# EAGLE design Audio-6 (EAGLE 7.2.0)
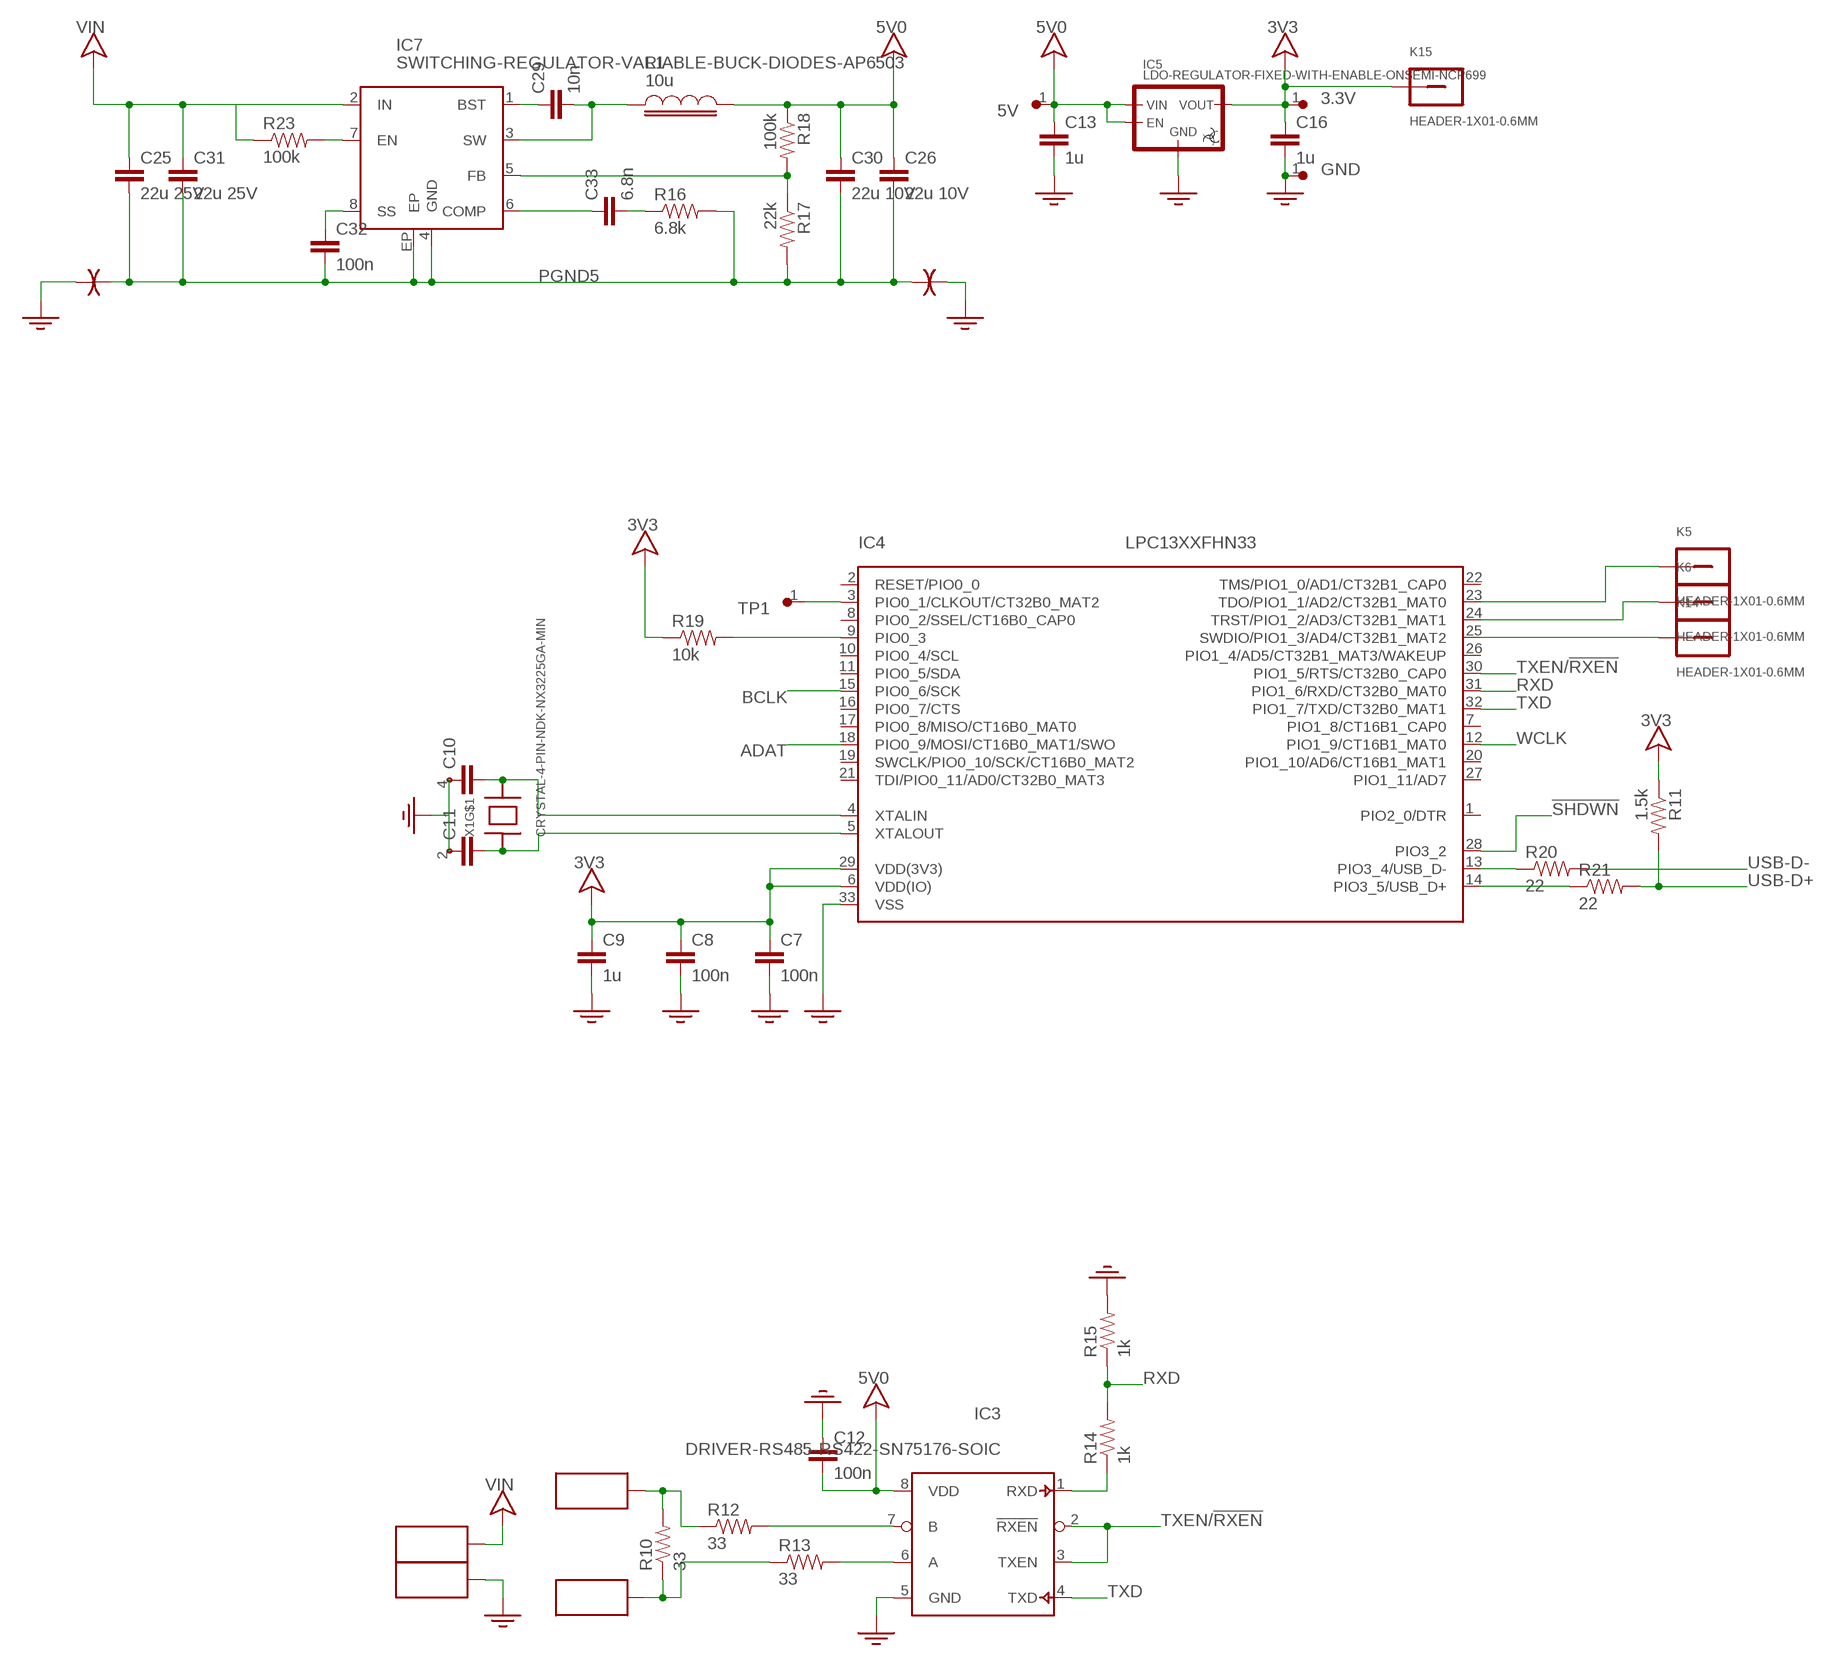
[diagram p0: schematic, sheet 1, part 1 of 2]
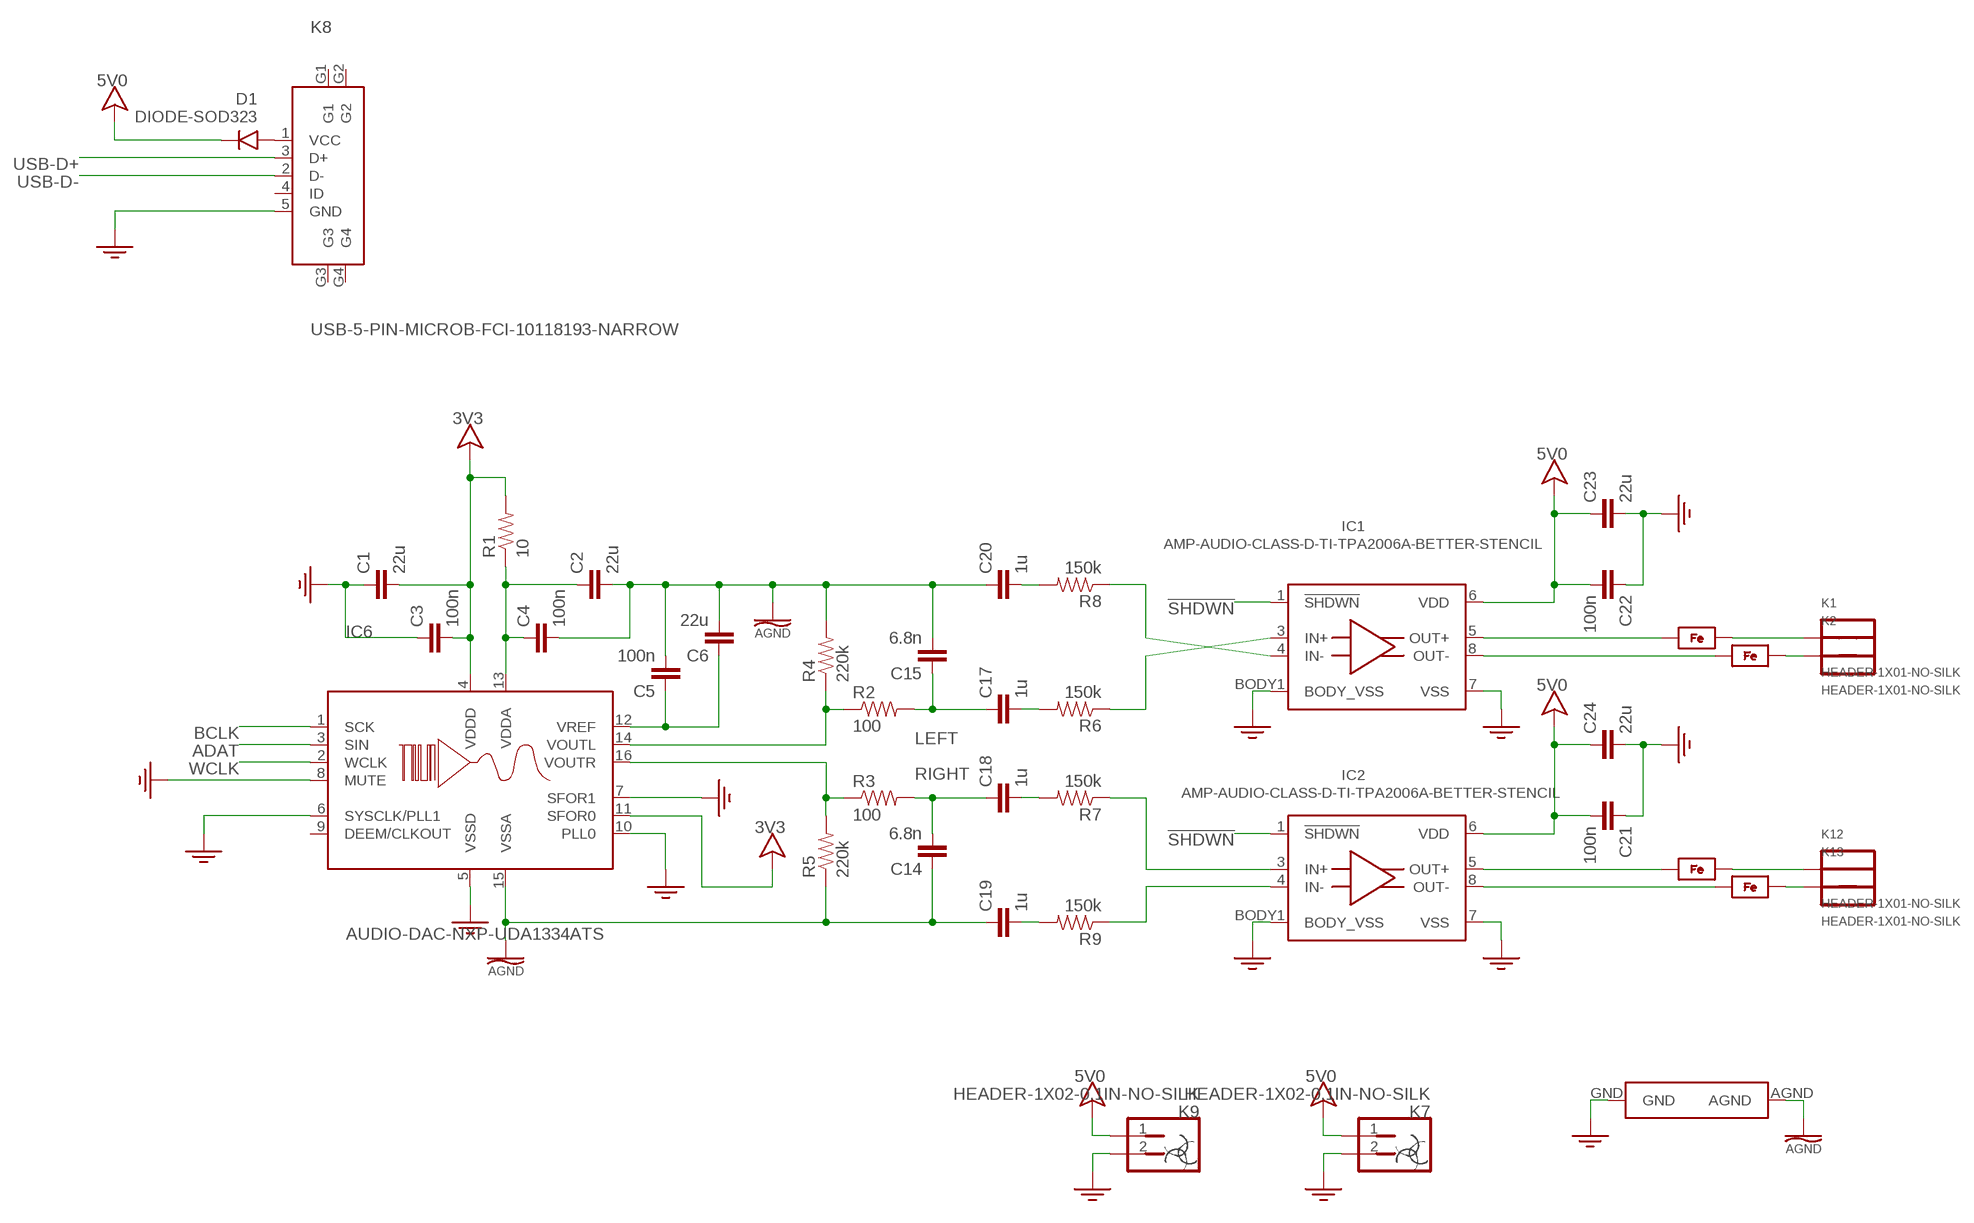
[diagram p1: schematic, sheet 1, part 2 of 2]

## Parts
3.3V  TEST-POINT-0.75MM  [TEST-POINT-0.75MM]
5V  TEST-POINT-0.75MM  [TEST-POINT-0.75MM]
C1  22u  CAP-1206-MIN  [1206-MIN]
C2  22u  CAP-1206-MIN  [1206-MIN]
C3  100n  CAP-0603-MIN  [0603-MIN]
C4  100n  CAP-0603-MIN  [0603-MIN]
C5  100n  CAP-0603-MIN  [0603-MIN]
C6  22u  CAP-1206-MIN  [1206-MIN]
C7  100n  CAP-0603-MIN  [0603-MIN]
C8  100n  CAP-0603-MIN  [0603-MIN]
C9  1u  CAP-0603-MIN  [0603-MIN]
C10  CAP-0603-MIN  [0603-MIN]
C11  CAP-0603-MIN  [0603-MIN]
C12  100n  CAP-0603-MIN  [0603-MIN]
C13  1u  CAP-0603-MIN  [0603-MIN]
C14  6.8n  CAP-0603-MIN  [0603-MIN]
C15  6.8n  CAP-0603-MIN  [0603-MIN]
C16  1u  CAP-0603-MIN  [0603-MIN]
C17  1u  CAP-0603-MIN  [0603-MIN]
C18  1u  CAP-0603-MIN  [0603-MIN]
C19  1u  CAP-0603-MIN  [0603-MIN]
C20  1u  CAP-0603-MIN  [0603-MIN]
C21  100n  CAP-0603-MIN  [0603-MIN]
C22  100n  CAP-0603-MIN  [0603-MIN]
C23  22u  CAP-1206-MIN  [1206-MIN]
C24  22u  CAP-1206-MIN  [1206-MIN]
C25  22u 25V  CAP-1206  [1206]
C26  22u 10V  CAP-1206  [1206]
C29  10n  CAP-0603-MIN  [0603-MIN]
C30  22u 10V  CAP-1206  [1206]
C31  22u 25V  CAP-1206  [1206]
C32  100n  CAP-0603-MIN  [0603-MIN]
C33  6.8n  CAP-0603-MIN  [0603-MIN]
D1  DIODE-SOD323  [SOD323]
FB1  FERRITE-BEAD-0603-MIN  [0603-MIN]
FB2  FERRITE-BEAD-0603-MIN  [0603-MIN]
FB3  FERRITE-BEAD-0603-MIN  [0603-MIN]
FB4  FERRITE-BEAD-0603-MIN  [0603-MIN]
GND  TEST-POINT-0.75MM  [TEST-POINT-0.75MM]
IC1  AMP-AUDIO-CLASS-D-TI-TPA2006A-BETTER-STENCIL  [QFN8-3X3MM-TI-TPA200X-BETTER-STENCIL]
IC2  AMP-AUDIO-CLASS-D-TI-TPA2006A-BETTER-STENCIL  [QFN8-3X3MM-TI-TPA200X-BETTER-STENCIL]
IC3  DRIVER-RS485-RS422-SN75176-SOIC  [EIAJ-SOIC8]
IC4  LPC13XXFHN33  [HVQFN33-7X7MM]
IC5  LDO-REGULATOR-FIXED-WITH-ENABLE-ONSEMI-NCP699  [SOT23-5]
IC6  AUDIO-DAC-NXP-UDA1334ATS  [TSSOP16]
IC7  SWITCHING-REGULATOR-VARIABLE-BUCK-DIODES-AP6503  [EIAJ-SOIC8-3.9MM-EXPOSED-PAD]
K1  HEADER-1X01-NO-SILK  [HEADER-1X01-NO-SILK]
K2  HEADER-1X01-NO-SILK  [HEADER-1X01-NO-SILK]
K3  SPEAKER-BLOCK  [SPEAKER-BLOCK]
K4  SPEAKER-BLOCK  [SPEAKER-BLOCK]
K5  HEADER-1X01-0.6MM  [HEADER-1X01-0.6MM-DIAM]
K6  HEADER-1X01-0.6MM  [HEADER-1X01-0.6MM-DIAM]
K7  HEADER-1X02-0.1IN-NO-SILK  [HEADER-1X02-NO-SILK]
K8  USB-5-PIN-MICROB-FCI-10118193-NARROW  [USB-MICROB-FCI-10118193-NARROW]
K9  HEADER-1X02-0.1IN-NO-SILK  [HEADER-1X02-NO-SILK]
K10  SPEAKER-BLOCK  [SPEAKER-BLOCK]
K11  SPEAKER-BLOCK  [SPEAKER-BLOCK]
K12  HEADER-1X01-NO-SILK  [HEADER-1X01-NO-SILK]
K13  HEADER-1X01-NO-SILK  [HEADER-1X01-NO-SILK]
K14  HEADER-1X01-0.6MM  [HEADER-1X01-0.6MM-DIAM]
K15  HEADER-1X01-0.6MM  [HEADER-1X01-0.6MM-DIAM]
L1  10u  INDUCTOR-6X6MM  [INDUCTOR-SMD-6X6MM]
R1  10  RESISTOR-0603-MIN  [0603-MIN]
R2  100  RESISTOR-0603-MIN  [0603-MIN]
R3  100  RESISTOR-0603-MIN  [0603-MIN]
R4  220k  RESISTOR-0603-MIN  [0603-MIN]
R5  220k  RESISTOR-0603-MIN  [0603-MIN]
R6  150k  RESISTOR-0603-MIN  [0603-MIN]
R7  150k  RESISTOR-0603-MIN  [0603-MIN]
R8  150k  RESISTOR-0603-MIN  [0603-MIN]
R9  150k  RESISTOR-0603-MIN  [0603-MIN]
R10  33  RESISTOR-0805  [0805-MIN]
R11  1.5k  RESISTOR-0603-MIN  [0603-MIN]
R12  33  RESISTOR-0805  [0805-MIN]
R13  33  RESISTOR-0805  [0805-MIN]
R14  1k  RESISTOR-0603-MIN  [0603-MIN]
R15  1k  RESISTOR-0603-MIN  [0603-MIN]
R16  6.8k  RESISTOR-0603-MIN  [0603-MIN]
R17  22k  RESISTOR-0603-MIN  [0603-MIN]
R18  100k  RESISTOR-0603-MIN  [0603-MIN]
R19  10k  RESISTOR-0603-MIN  [0603-MIN]
R20  22  RESISTOR-0603-MIN  [0603-MIN]
R21  22  RESISTOR-0603-MIN  [0603-MIN]
R23  100k  RESISTOR-0603-MIN  [0603-MIN]
TP1  TEST-POINT-0.75MM  [TEST-POINT-0.75MM]
U1  GND-ISOLATOR-0.032"  [GND-ISOLATOR-0.032"]
U4  GND-ISOLATOR-0.032"  [GND-ISOLATOR-0.032"]
U$4  GND-AGND-CONNECTION  [GND-AGND-CONNECTION]
X1  CRYSTAL-4-PIN-NDK-NX3225GA-MIN  [CRYSTAL-NDK-NX3225GA-3X2.5MM-MIN]

## Nets
3V3: 3.3V.1 C1.1 C3.1 C7.2 C8.2 C9.2 C16.2 IC4.6(VDD(IO)) IC4.29(VDD(3V3)) IC5.5(VOUT) IC6.4(VDDD) IC6.11(SFOR0) K15.P$1 R1.2 R11.1 R19.1 ; supply symbol labelled V
5V0: 5V.1 C12.1 C13.2 C21.1 C22.1 C23.2 C24.2 C26.2 C30.2 D1.K IC1.6(VDD) IC2.6(VDD) IC3.8(VDD) IC5.1(VIN) IC5.3(EN) K7.1 K9.1 L1.2 R18.1 ; supply symbol labelled V
5V0FB: IC7.5(FB) R17.1 R18.2
!SHDWN: IC1.1(!SHDWN) IC2.1(!SHDWN) IC4.28(PIO3_2)
ADAT: IC4.18(PIO0_9/MOSI/CT16B0_MAT1/SWO) IC6.3(SIN)
AGND: C2.1 C4.1 C5.1 C6.1 C14.2 C15.1 C19.2 C20.2 IC6.15(VSSA) R4.2 R5.1 U$4.AGND
BCLK: IC4.15(PIO0_6/SCK) IC6.1(SCK)
BOOT: IC4.3(PIO0_1/CLKOUT/CT32B0_MAT2) TP1.1
D+: IC4.14(PIO3_5/USB_D+) R21.1
D-: IC4.13(PIO3_4/USB_D-) R20.1
GND: C1.2 C3.2 C7.1 C8.1 C9.1 C10.2 C11.2 C12.2 C13.1 C16.1 C21.2 C22.2 C23.1 C24.1 GND.1 IC1.7(VSS) IC1.BODY1(BODY_VSS) IC2.7(VSS) IC2.BODY1(BODY_VSS) IC3.5(GND) IC4.33(VSS) IC5.2(GND) IC6.5(VSSD) IC6.6(SYSCLK/PLL1) IC6.7(SFOR1) IC6.8(MUTE) IC6.10(PLL0) K4.P$1 K7.2 K8.5(GND) K9.2 R15.2 U1.A U4.B U$4.GND X1.2 X1.4
IC1-: IC1.4(IN-) R8.1
IC1OUT+: FB1.2 K1.1
IC1OUT-: FB2.2 K2.1
IC1SE: IC6.14(VOUTL) R2.1 R4.1
IC2+: IC2.3(IN+) R7.1
IC2-: IC2.4(IN-) R9.1
IC2OUT+: FB3.2 K12.1
IC2OUT-: FB4.2 K13.1
IC2SE: IC6.16(VOUTR) R3.1 R5.2
IO1: IC4.23(TDO/PIO1_1/AD2/CT32B1_MAT0) K5.P$1
IO2: IC4.24(TRST/PIO1_2/AD3/CT32B1_MAT1) K6.P$1
IO3: IC4.25(SWDIO/PIO1_3/AD4/CT32B1_MAT2) K14.P$1
LEFT: C15.2 C17.2 R2.2
N$1: IC1.3(IN+) R6.1
N$2: IC4.9(PIO0_3) R19.2
N$3: C10.1 IC4.4(XTALIN) X1.3
N$4: C11.1 IC4.5(XTALOUT) X1.1
N$7: IC3.7(B) R12.2
N$10: C17.1 R6.2
N$11: C18.1 R7.2
N$12: IC3.6(A) R13.2
N$13: C29.1 IC7.3(SW) L1.1
N$14: IC3.1(RXD) R14.1
N$15: C29.2 IC7.1(BST)
N$16: C33.2 IC7.6(COMP)
N$17: C33.1 R16.1
N$20: C32.2 IC7.8(SS)
N$22: D1.A K8.1(VCC)
N$24: C2.2 C4.2 IC6.13(VDDA) R1.1
N$28: IC7.7(EN) R23.2
N$40: C19.1 R9.2
N$41: C20.1 R8.2
N$43: FB1.1 IC1.5(OUT+)
N$44: FB2.1 IC1.8(OUT-)
N$45: FB3.1 IC2.5(OUT+)
N$46: FB4.1 IC2.8(OUT-)
PGND5: C25.1 C26.1 C30.1 C31.1 C32.1 IC7.4(GND) IC7.EP R16.2 R17.2 U1.B U4.A
RIGHT: C14.1 C18.2 R3.2
RS485D+: K11.P$1 R10.1 R13.1
RS485D-: K10.P$1 R10.2 R12.1
RXD: IC4.31(PIO1_6/RXD/CT32B0_MAT0) R14.2 R15.1
TXD: IC3.4(TXD) IC4.32(PIO1_7/TXD/CT32B0_MAT1)
TXEN/!RXEN: IC3.2(!RXEN) IC3.3(TXEN) IC4.30(PIO1_5/RTS/CT32B0_CAP0)
USB-D+: K8.3(D+) R11.2 R21.2
USB-D-: K8.2(D-) R20.2
VIN: C25.2 C31.2 IC7.2(IN) K3.P$1 R23.1 ; supply symbol labelled V
VREF: C5.2 C6.2 IC6.12(VREF)
WCLK: IC4.12(PIO1_9/CT16B1_MAT0) IC6.2(WCLK)
Unconnected: IC4.1(PIO2_0/DTR) IC4.2(RESET/PIO0_0) IC4.7(PIO1_8/CT16B1_CAP0) IC4.8(PIO0_2/SSEL/CT16B0_CAP0) IC4.10(PIO0_4/SCL) IC4.11(PIO0_5/SDA) IC4.16(PIO0_7/CTS) IC4.17(PIO0_8/MISO/CT16B0_MAT0) IC4.19(SWCLK/PIO0_10/SCK/CT16B0_MAT2) IC4.20(PIO1_10/AD6/CT16B1_MAT1) IC4.21(TDI/PIO0_11/AD0/CT32B0_MAT3) IC4.22(TMS/PIO1_0/AD1/CT32B1_CAP0) IC4.26(PIO1_4/AD5/CT32B1_MAT3/WAKEUP) IC4.27(PIO1_11/AD7) IC6.9(DEEM/CLKOUT) K8.4(ID) K8.G1 K8.G2 K8.G3 K8.G4

## Library data of the parts
3.3V 5V GND TP1 = Outbreak:TEST-POINT
C1-C26 C29-C33 = Outbreak:CAP
D1 = Outbreak:DIODE
FB1-FB4 = Outbreak:FERRITE-BEAD
IC1 IC2 = Outbreak:AMP-AUDIO-CLASS-D-TI-TPA2006A
IC3 = Outbreak:DRIVER-RS485-RS422-SN75176
IC4 = Outbreak:LPC13XXFHN33: LPC1313 72 MHz 32-bit ARM Cortex-M3 based microcontroller featuring a high level of integration and low power consumption. 32 kB Flash, 8 kB SRAM MarcVl - Datasheet available on www.nxp.com
IC5 = Outbreak:LDO-REGULATOR-FIXED-WITH-ENABLE: Low Drop-Out (LDO) Volt Regulator with enable pin (active at logic high.)
IC6 = Outbreak:AUDIO-DAC-NXP-UDA1334ATS
IC7 = Outbreak:SWITCHING-REGULATOR-VARIABLE-BUCK-DIODES-AP6503
K1 K2 K5 K6 K12-K15 = Outbreak:HEADER-1X01
K3 K4 K10 K11 = BMan:SPEAKER-BLOCK
K7 K9 = Outbreak:HEADER-1X02
K8 = Outbreak:USB-5-PIN
L1 = Outbreak:INDUCTOR
R1-R21 R23 = Outbreak:RESISTOR: Resistor Basic schematic elements and footprints for 0603, 1206, and PTH resistors.
U1 U4 = Outbreak:GND-ISOLATOR
U$4 = Outbreak:GND-AGND-CONNECTION
X1 = Outbreak:CRYSTAL-4-PIN

## Board
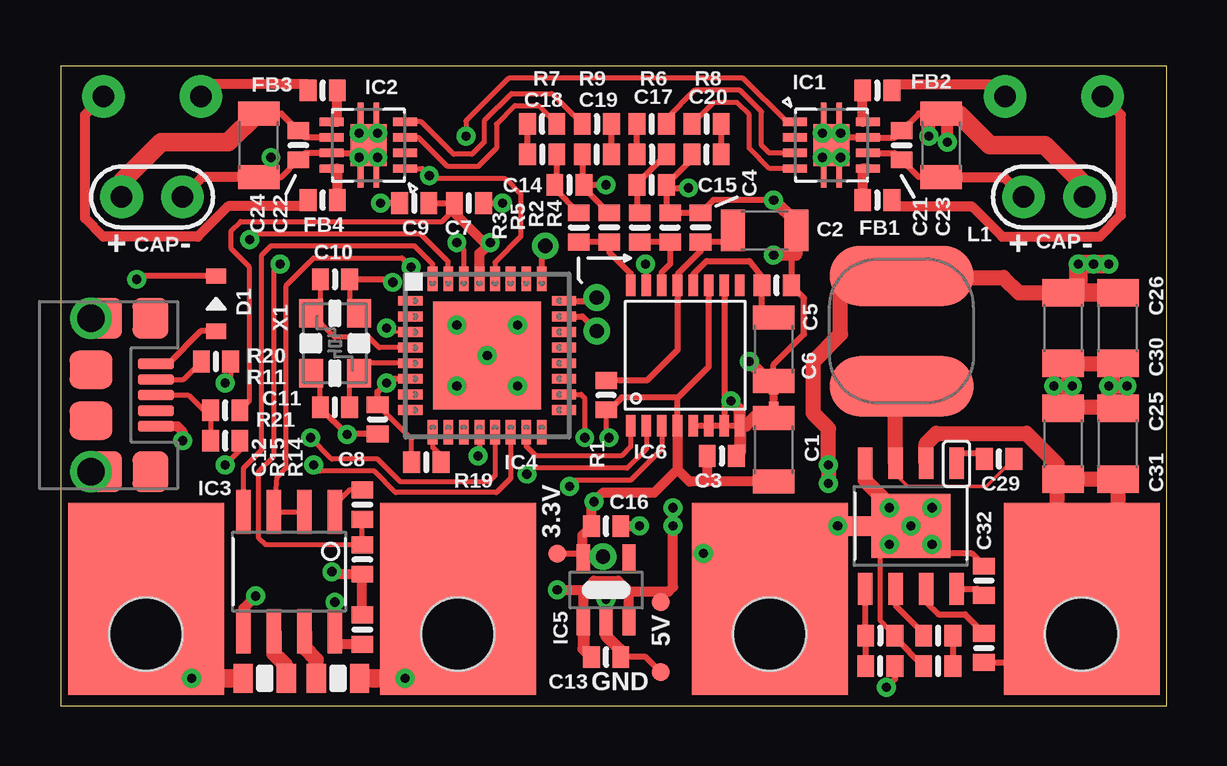
[diagram p2: board, top side]
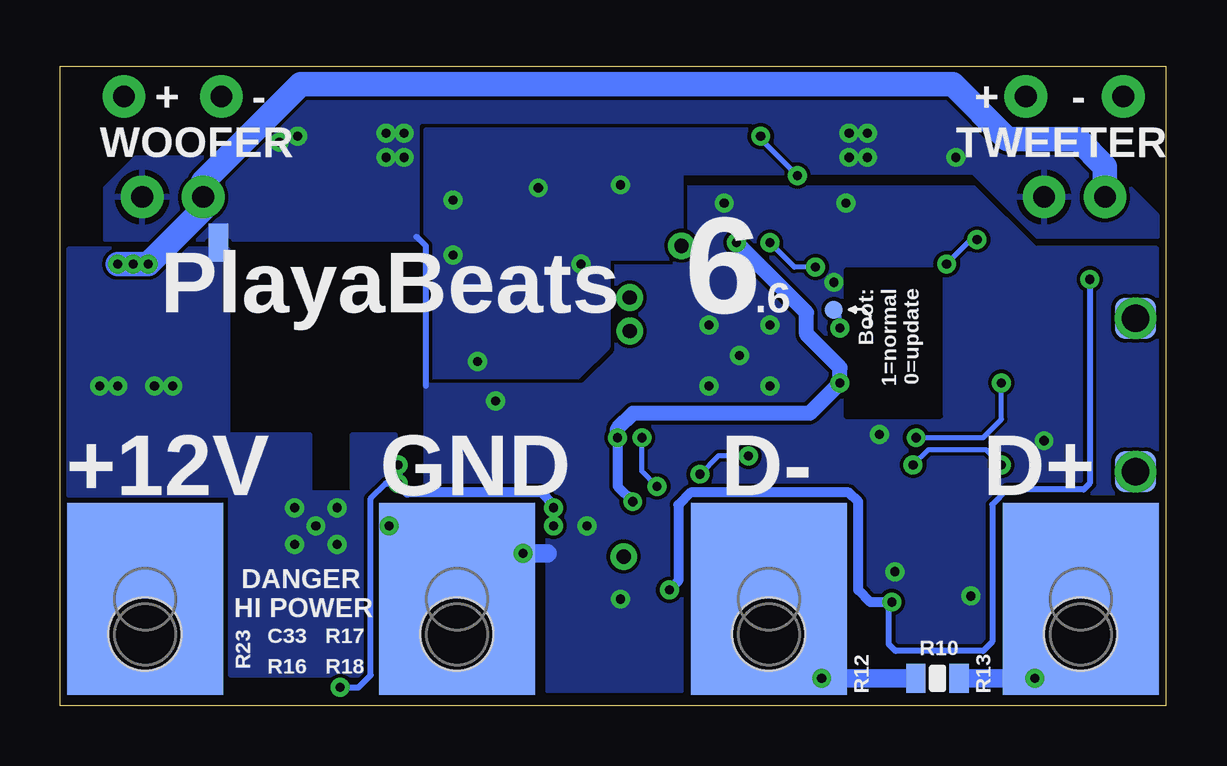
[diagram p3: board, bottom side, seen from below]

Size 46.1 x 26.67 mm. Coordinates in mm from the lower left corner, seen from the top.
Outline: 0,0 46.1,0 46.1,26.67 0,26.67 0,0
Copper layers (1*16): Top 0.035mm / dielectric 1.5mm / Bottom 0.035mm
Design rules "default *": minimum track width 6mil, minimum drill 15mil, track to track 6mil, track to pad 6mil, pad to pad 6mil, via to via 6mil, smd to smd 0mil, copper to edge 10mil, drill to drill 8mil, minimum pad ring 10mil, minimum via ring 8mil, stop-mask expansion 4mil, vias tented up to drill 20mil, thermal gap 10mil

### Footprints (pad centres in the part's own frame; a part is rotated, then mirrored left to right if it is on the bottom)
TEST-POINT-0.75MM = smd 0.75 x 0.75: 1 0,0
1206-MIN = smd 1 x 1.727: 1 -1.323,0; 2 1.323,0
0603-MIN = smd 0.7 x 0.9: 1 -0.61,0; 2 0.61,0
1206 = smd 1.143 x 1.727: 1 -1.473,0; 2 1.473,0
SOD323 = smd 0.63 x 0.83: A -1.15,0; K 1.15,0
QFN8-3X3MM-TI-TPA200X-BETTER-STENCIL = smd 0.35 x 1: 1 0.975,1.525; 2 0.325,1.525; 3 -0.325,1.525; 4 -0.975,1.525; 5 -0.975,-1.525; 6 -0.325,-1.525; 7 0.325,-1.525; 8 0.975,-1.525 | smd 1.75 x 1.5: BODY1 0,0 | smd 0.9 x 0.23: BODY2 -1.325,0.325; BODY3 -1.325,-0.325; BODY4 1.325,-0.325; BODY5 1.325,0.325
EIAJ-SOIC8 = smd 1.829 x 0.61: 1 -2.491,1.905; 2 -2.491,0.635; 3 -2.491,-0.635; 4 -2.491,-1.905; 5 2.491,-1.905; 6 2.491,-0.635; 7 2.491,0.635; 8 2.491,1.905
HVQFN33-7X7MM = smd 1.013 x 0.406: 1 -3.2,2.275; 2 -3.2,1.625; 3 -3.2,0.975; 4 -3.2,0.325; 5 -3.2,-0.325; 6 -3.2,-0.975; 7 -3.2,-1.625; 8 -3.2,-2.275; 17 3.2,-2.275; 18 3.2,-1.625; 19 3.2,-0.975; 20 3.2,-0.325; 21 3.2,0.325; 22 3.2,0.975; 23 3.2,1.625; 24 3.2,2.275 | smd 0.406 x 1.013: 9 -2.275,-3.2; 10 -1.625,-3.2; 11 -0.975,-3.2; 12 -0.325,-3.2; 13 0.325,-3.2; 14 0.975,-3.2; 15 1.625,-3.2; 16 2.275,-3.2; 25 2.275,3.2; 26 1.625,3.2; 27 0.975,3.2; 28 0.325,3.2; 29 -0.325,3.2; 30 -0.975,3.2; 31 -1.625,3.2; 32 -2.275,3.2 | smd 4.5 x 4.5: 33 0,0
SOT23-5 = smd 0.55 x 1.2: 1 0.95,1.3; 2 0,1.3; 3 -0.95,1.3; 4 -0.95,-1.3; 5 0.95,-1.3
TSSOP16 = smd 0.4 x 0.9: 1 2.275,2.925; 2 1.625,2.925; 3 0.975,2.925; 4 0.325,2.925; 5 -0.325,2.925; 6 -0.975,2.925; 7 -1.625,2.925; 8 -2.275,2.925; 9 -2.275,-2.925; 10 -1.625,-2.925; 11 -0.975,-2.925; 12 -0.325,-2.925; 13 0.325,-2.925; 14 0.975,-2.925; 15 1.625,-2.925; 16 2.275,-2.925
EIAJ-SOIC8-3.9MM-EXPOSED-PAD = smd 1.321 x 0.61: 1 -2.618,1.905; 2 -2.618,0.635; 3 -2.618,-0.635; 4 -2.618,-1.905; 5 2.618,-1.905; 6 2.618,-0.635; 7 2.618,0.635; 8 2.618,1.905 | smd 2.66 x 3.3: EP 0,0
HEADER-1X01-NO-SILK = drill 0.9 pad 1.778: 1 0,0
SPEAKER-BLOCK = smd 8 x 6.5 bottom: P$1 0,0 | smd 8 x 6.5: P$2 0,0 | hole 3.048: -1.46,0
HEADER-1X01-0.6MM-DIAM = drill 0.6: P$1 0,0
HEADER-1X02-NO-SILK = drill 0.9 pad 1.778: 1 -1.27,0; 2 1.27,0
USB-MICROB-FCI-10118193-NARROW = smd 0.44 x 1.5: 1 -1.3,2.7; 2 -0.65,2.7; 3 0,2.7; 4 0.65,2.7; 5 1.3,2.7 | smd 1.7 x 1.5: G1 -3.2,2.473; G4 3.2,2.473 | smd 1.6 x 1.8: G2 -1.055,0; G3 1.075,0 | smd 1.72 x 1.72 bottom: G5 -3.2,0; G7 3.2,0 | smd 1.72 x 1.3: G6 -3.2,0.635; G8 3.2,0.635 | drill 1.15 pad 1.7: P$1 -3.2,0; P$2 3.2,0
INDUCTOR-SMD-6X6MM = smd 2.5 x 6: 1 -2.3,0; 2 2.3,0
0805-MIN = smd 0.8 x 1.2: 1 -0.9,0; 2 0.9,0
GND-ISOLATOR-0.032" = smd 0.813 x 0.813: A -0.381,0; B 0.381,0
GND-AGND-CONNECTION = smd 0.406 x 0.406: AGND 0.356,0; GND -0.356,0
CRYSTAL-NDK-NX3225GA-3X2.5MM-MIN = smd 1.2 x 1: 1 -1.25,-1; 2 1.25,-1; 3 1.25,1; 4 -1.25,1

### Placement (x,y rotation side)
3.3V  20.7,6.35 0 top
5V  25.02,4.32 0 top
C1  29.72,10.67 90 top
C2  29.34,19.81 180 top
C3  27.56,10.41 0 top
C4  26.67,19.94 270 top
C5  29.84,17.53 180 top
C6  29.72,14.86 90 top
C7  17.02,20.95 180 top
C8  13.21,11.94 90 top
C9  14.73,20.95 0 top
C10  11.43,17.78 0 top
C11  11.43,12.45 180 top
C12  12.57,3.17 90 top
C13  22.73,2.03 180 top
C14  21.21,21.72 0 top
C15  24.64,21.72 180 top
C16  22.73,7.49 180 top
C17  24.64,22.99 0 top
C18  20.07,22.99 0 top
C19  22.35,22.99 180 top
C20  26.92,22.99 180 top
C21  35.05,23.37 90 top
C22  9.91,23.37 270 top
C23  36.7,23.37 270 top
C24  8.26,23.37 90 top
C25  44.07,10.92 270 top
C26  44.07,15.75 90 top
C29  39.12,10.29 180 top
C30  41.78,15.75 90 top
C31  41.78,10.92 270 top
C32  38.48,5.21 270 top
C33  36.58,2.92 180 top
D1  6.48,16.76 90 top
FB1  34.04,21.08 0 top
FB2  34.04,25.65 0 top
FB3  10.92,25.65 180 top
FB4  10.92,21.08 180 top
GND  25.02,1.4 180 top
IC1  32.13,23.37 90 top
IC2  12.83,23.37 270 top
IC3  9.53,5.59 270 top
IC4  17.78,14.61 0 top
IC5  22.73,4.83 180 top
IC6  26.04,14.61 180 top
IC7  35.43,7.49 270 top
K1  43.43,25.4 0 top
K2  39.37,25.4 0 top
K3  42.56,4.45 90 bottom
K4  29.56,4.45 90 bottom
K5  22.35,15.62 90 top
K6  22.35,17.02 90 top
K7  41.4,21.21 0 top
K8  1.27,12.95 270 top
K9  3.81,21.21 0 top
K10  16.56,4.45 90 bottom
K11  3.56,4.45 90 bottom
K12  5.84,25.4 90 top
K13  1.78,25.4 90 top
K14  20.19,19.18 90 top
K15  22.61,6.22 0 top
L1  35.05,15.62 90 top
R1  22.73,12.95 270 top
R2  24.13,19.94 90 top
R3  21.59,19.94 90 top
R4  25.4,19.94 90 top
R5  22.86,19.94 270 top
R6  24.64,24.26 180 top
R7  20.07,24.26 180 top
R8  26.92,24.26 0 top
R9  22.35,24.26 0 top
R10  9.53,1.14 180 bottom
R11  6.86,12.32 180 top
R12  11.56,1.14 180 top
R13  8.51,1.14 0 top
R14  12.57,8.38 270 top
R15  12.57,6.1 270 top
R16  36.58,1.65 180 top
R17  34.16,2.92 0 top
R18  34.16,1.65 180 top
R19  15.24,10.16 0 top
R20  6.48,14.35 180 top
R21  6.86,11.05 180 top
R23  38.48,2.41 90 top
TP1  13.84,16.51 90 bottom
U1  39.5,19.3 270 bottom
U4  33.27,7.49 180 top
U$4  29.72,12.83 90 top
X1  11.43,15.11 90 top

### Tracks (layer width: path | path; a pad name or v marks a point on that pad's centre or on a via)
3V3  (via drill 0.38)
  Top 0.203: R11.1 7.87,12.72 7.87,18.29 7.11,19.05 7.11,19.81 7.49,20.19 15.9,20.19 16.41,20.7 | C8.2 14.63,11.12 R19.1 | R1.2 22.73,11.3 v22.86,11.18
  Top 0.254: 21.74,6.17 IC5.5 | IC6.4 25.71,12.85 | 25.71,12.85 23.39,12.85 22.86,12.32 R1.2 | IC6.11 27.01,14.12 25.74,12.85 25.71,12.85 | C8.2 13.21,13.08 v13.59,13.46 13.76,13.63 IC4.6 | C9.2 C7.2 | 3.3V.1 21.78,6.35 IC5.5 | K15.P$1 21.88,6.22 IC5.5
  Top 0.406: 21.74,6.17 21.74,7.11 C16.2 22.12,8.41 v22.23,8.51 22.61,8.89 24.75,8.89 25.71,9.85 | IC6.4 25.71,9.85 | C1.1 26.95,9.35 | 26.95,9.35 26.21,9.35 25.71,9.85 | C3.1 26.95,9.35 | IC4.29 17.45,18.85 v17.91,19.3 17.65,19.3 16.41,20.55 16.41,20.7 C7.2
  Top 0.508: IC5.5 21.78,5.78
  Bottom 0.406: v22.86,11.18 22.86,9.14 v22.23,8.51
  Bottom 0.635: v22.86,11.18 22.86,11.56 22.23,12.19 14.86,12.19 v13.59,13.46 13.59,14.1 14.99,15.49 14.99,16.38 v17.91,19.3
5V0  (via drill 0.38)
  Top 0.203: 11.56,2.56 IC3.8
  Top 0.254: IC2.6 10.19,23.69 C22.1 9.19,24.69 C24.2 | IC1.6 34.77,23.04 C21.1 35.77,22.05 C23.2 | v32,9.27 32,9.78 | D1.K 3.31,17.91 v3.17,17.78 | 5V.1 25.02,4.76 24.51,4.76 | R18.1 34.77,1.12 v34.42,0.76
  Top 0.406: IC5.1 21.78,4.76 | 21.78,4.76 22.23,5.21 23.24,5.21 23.68,4.76 | IC5.3 23.68,4.76 | C12.1 11.56,2.56 | C23.2 39.32,22.05 K7.1 | v20.7,4.83 21.72,4.83 21.78,4.76 | 23.68,4.76 24.51,4.76 25.34,4.76 25.53,4.95 v25.53,7.49 v25.53,8.26 | L1.2 35.05,17.86 | IC3.8 v11.43,4.32
  Top 0.508: IC5.1 21.78,2.37 C13.2
  Top 0.635: v32,9.27 v32,10.03 32,11.56 31.37,12.19 31.37,14.35 32.51,15.49 32.51,17.92 L1.2 | 42.42,17.22 C30.2 39.93,17.22 39.29,17.86 35.05,17.86
  Top 0.762: C24.2 8.18,24.69 6.99,23.5 4.19,23.5 2.54,21.84 K9.1 | v43.69,18.41 v43.05,18.41 v42.42,18.41 42.42,17.22 C26.2
  Bottom 0.254: v3.17,17.78 3.17,9.27 3.43,9.02 6.6,9.02 7.24,8.38 7.24,2.67 7.62,2.29 11.28,2.29 11.56,2.56 11.56,4.19 v11.43,4.32 | v34.42,0.76 33.66,0.76 33.15,1.27 33.15,8.64 32.51,9.27 v32,9.27
  Bottom 0.406: v11.43,4.32 12.32,4.32 12.83,4.83 12.83,8.51 13.21,8.89 19.81,8.89 20.32,8.38 20.32,5.21 v20.7,4.83 | v25.53,8.26 25.53,8.38 26.04,8.89 31.62,8.89 v32,9.27 v32,10.03
  Bottom 1.016: K9.1 2.54,22.48 3.68,23.62 6.6,23.62 8.89,25.91 36.07,25.91 40.13,21.84 K7.1 40.13,20.7 v42.42,18.41 | v43.69,18.41 v42.42,18.41 | v43.05,18.41 v42.42,18.41
5V0FB
  Top 0.254: R18.2 R17.1 33.55,2.95 33.53,3.05 IC7.5
!SHDWN  (via drill 0.38)
  Top 0.203: IC1.1 30.27,24.34 28.45,26.16 18.67,26.16 16.89,24.38 v16.89,23.75 | IC4.28 18.11,18.49 19.18,19.56 19.18,21.34 18.54,21.97 15.49,21.97 v15.37,22.1 15.07,22.39 IC2.1
  Bottom 0.203: v16.89,23.75 16.89,23.62 v15.37,22.1
ADAT  (via drill 0.38)
  Top 0.203: IC4.18 21.69,12.98 21.84,12.83 v21.84,11.18 | IC6.3 25.06,10.71 23.75,9.4 21.46,9.4 v21.21,9.14
  Bottom 0.203: v21.21,9.14 21.84,9.78 v21.84,11.18
AGND  (via drill 0.38)
  Top 0.254: 25.25,21.59 25.25,20.55 R4.2 C4.1 27.2,21.08 v29.72,21.08 | 30.66,20.14 C2.1 30.45,19.81 C5.1 30.99,16.99 30.99,15.49 29.72,14.22 C6.1 U$4.AGND | IC6.15 24.41,18.39 v24.38,18.41 | C20.2 26.31,22.78 C15.1 25.25,21.59 | 25.25,21.59 v26.16,21.59 | C19.2 21.74,21.72 C14.2 | R5.1 21.82,21.59 C14.2 | C14.2 v22.73,21.72
  Top 0.508: 30.66,20.14 v29.72,21.08 | C6.1 29.52,13.54 v28.7,14.35 | C2.1 30.66,18.8 v29.72,18.8
  pour Bottom: 14.35,24 30.86,24 30.86,13.72 24.51,13.72 23.24,14.99 23.24,18.67 20.19,18.67 20.19,22.23 14.35,22.23
BCLK
  Top 0.203: IC6.1 23.76,10.81 23.37,10.41 19.81,10.41 19.41,10.82 IC4.15
BOOT  (via drill 0.38)
  Top 0.152: IC4.3 13.76,15.58 v13.59,15.75
  Bottom 0.152: v13.59,15.75 13.59,16.26 TP1.1
D+  (via drill 0.38)
  Top 0.203: IC4.14 18.75,9.48 18.16,8.89 13.97,8.89 13.08,9.78 10.79,9.78 v10.54,10.03 | v6.86,10.03 7.47,10.64 R21.1
  Bottom 0.203: v6.86,10.03 7.49,10.67 9.91,10.67 v10.54,10.03
D-  (via drill 0.38)
  Top 0.203: IC4.13 18.11,9.6 17.84,9.34 14.16,9.34 13.21,10.29 11.3,10.29 v10.41,11.18 | R20.1 7.09,13.74 v6.86,13.46
  Bottom 0.203: v10.41,11.18 7.62,11.18 6.86,11.94 v6.86,13.46
GND  (via drill 0.38)
  Top 0.203: C10.2 12.04,16.63 X1.2 | C11.2 10.82,13.47 X1.4
  Top 0.254: IC6.10 IC6.7 | IC6.5 IC6.6 IC6.7 | IC6.7 IC6.8 | IC1.BODY1 32.13,23.69 IC1.7 34.77,23.69 C21.2 35.77,24.69 36.2,24.69 | IC2.BODY1 12.83,23.04 IC2.7 10.19,23.04 C22.2 9.19,22.05 8.76,22.05 | U$4.GND C1.2 | C8.1 11.96,11.33 v11.94,11.3 10.82,12.42 C11.2 | C10.2 13.72,17.78 v13.84,17.65 | C9.1 v13.34,20.95 | C7.1 v18.41,20.95 | GND.1 24.38,2.03 C13.1
  Top 0.406: C23.1 37.41,24.69 | C24.1 5.89,22.05 K9.2 | K8.5 4.86,11.65 5.08,11.43 v5.08,11.05 | IC3.5 7.62,4.06 v8.13,4.57 | C16.1 v24.13,7.49 | C12.2 R15.2 11.4,5.49 v11.3,5.59
  Top 0.508: v22.73,4.45 IC5.2 22.73,2.92 23.34,2.31 C13.1 | IC6.8 28.57,11.68 29.01,12.12 C1.2 | IC6.8 28.31,10.55 C3.2 | C23.1 36.2,24.69 v36.2,23.75 | C24.1 8.76,22.05 v8.76,22.86 | IC6.8 28.31,12.33 v27.94,12.7 | v36.96,23.5 36.96,24.64 36.7,24.64
  Top 0.635: K4.P$1 28.96,6.35 v32.38,7.49 U4.B
  Top 0.762: 37.41,24.69 38.73,23.37 41.02,23.37 42.67,21.72 K7.2 | 28.96,6.35 v26.8,6.35
  Bottom 0.254: 31.24,19.56 30.86,19.18 30.86,13.34
  Bottom 0.762: v26.8,6.35 25.78,6.35
  other vias: 31.75,23.88 32.51,23.88 32.51,22.86 31.75,22.86 13.21,22.86 12.45,22.86 12.45,23.88 13.21,23.88 17.78,14.61 16.51,15.88 16.51,13.34 19.05,13.34 19.05,15.88
  pour Bottom (rank 3): 0.38,19.05 5.46,19.05 8,21.59 30.86,21.59 30.86,8.76 25.78,8.76 25.78,0.64 20.19,0.64 20.19,8.76 12.95,8.76 12.95,0.64 6.73,0.64 6.73,8.89 0.38,8.89
  pour Bottom (rank 4): 0.38,19.56 5.33,19.56 8,22.23 30.86,22.23 30.86,19.43 44.2,19.43 44.2,21.59 42.93,22.86 39.75,22.86 35.94,26.67 6.6,26.67 0.38,20.45
IC1-
  Top 0.203: IC1.4 29.55,22.39 28.7,23.24 28.7,24.64 28.19,25.15 27.2,25.15 R8.1
IC1OUT+
  Top 0.406: FB1.2 34.65,20.83 37.97,20.83 39.24,19.56 43.31,19.56 44.2,20.45 44.2,24.64 K1.1
IC1OUT-
  Top 0.406: FB2.2 34.65,25.91 38.86,25.91 K2.1
IC1SE
  Top 0.254: R2.1 R4.1 25.4,18.41 25.06,18.07 IC6.14
IC2+
  Top 0.203: R7.1 19.91,25.02 18.92,25.02 18.16,24.26 18.16,23.24 17.4,22.48 16.13,22.48 14.91,23.69 IC2.3
IC2-
  Top 0.203: R9.1 20.47,25.53 18.8,25.53 17.65,24.38 17.65,23.5 17.14,22.99 16.38,22.99 15.03,24.34 IC2.4
IC2OUT+
  Top 0.406: FB3.2 10.31,25.91 6.35,25.91 K12.1
IC2OUT-
  Top 0.406: FB4.2 10.31,20.83 6.99,20.83 5.71,19.56 1.78,19.56 1.02,20.32 1.02,24.64 K13.1
IC2SE
  Top 0.254: R5.2 R3.1 | R5.2 23.01,19.33 | IC6.16 23.76,18.02 22.86,18.92 R5.2
IO1
  Top 0.254: IC4.23 21.74,16.23 K5.P$1
IO2
  Top 0.254: IC4.24 22.21,16.88 K6.P$1
IO3
  Top 0.254: IC4.25 20.05,19.04 K14.P$1
LEFT
  Top 0.254: R2.2 24.03,20.55 C15.2 24.03,21.77 C17.2
N$1
  Top 0.203: IC1.3 29.54,23.04 29.21,23.37 29.21,24.77 28.32,25.65 26.42,25.65 25.25,24.49 R6.1
N$2
  Top 0.203: R19.2 15.85,10.44 15.51,10.78 IC4.9
N$3
  Top 0.203: C10.1 10.82,16.88 X1.3 11.43,15.37 12.83,15.37 13.28,14.93 IC4.4
N$4
  Top 0.152: 12.04,13.47 X1.1 12.43,14.21 12.5,14.28
  Top 0.203: C11.1 12.04,13.47 | IC4.5 12.5,14.28
N$7
  Top 0.635: IC3.7 10.16,2.41 10.66,1.92 R12.2
N$10
  Top 0.254: C17.1 R6.2
N$11
  Top 0.254: C18.1 R7.2
N$12
  Top 0.635: IC3.6 8.89,2.16 9.41,1.64 R13.2
N$13
  Top 0.152: 34.8,9.65 35.31,9.14 38.58,9.14 C29.1
  Top 0.203: IC7.3 34.8,9.65
  Top 0.635: IC7.3 34.8,13.34 34.43,13.32 L1.1
N$14
  Top 0.203: R14.1 12.04,8.99 11.56,8.51 IC3.1
N$15
  Top 0.254: IC7.1 37.34,10.54 38.51,10.54 C29.2
N$16
  Top 0.254: IC7.6 34.8,4.19 35.97,3.02 C33.2
N$17
  Top 0.254: C33.1 R16.1
N$20
  Top 0.254: IC7.8 38.2,4.88 C32.2
N$22
  Top 0.254: K8.1 4.47,14.25 5.83,15.61 D1.A
N$23
  cutout Bottom: 9.4,18.16 13.34,18.16 13.34,12.06 9.4,12.06
N$24
  Top 0.254: C2.2 28.01,19.33 C4.2 26.67,18.95 25.71,17.99 IC6.13 25.71,14.83 24.44,13.56 R1.1
N$28
  Top 0.254: IC7.7 36.07,4.32 36.58,3.81 37.69,3.81 R23.2
N$40
  Top 0.254: C19.1 R9.2
N$41
  Top 0.254: C20.1 R8.2
N$43
  Top 0.406: IC1.5 33.43,22.39 FB1.1
N$44
  Top 0.406: IC1.8 33.43,24.34 FB2.1
N$45
  Top 0.406: IC2.5 11.53,24.34 FB3.1
N$46
  Top 0.406: IC2.8 11.53,22.39 FB4.1
PGND5  (via drill 0.38)
  Top 0.152: 35.18,7.49 34.16,7.49 | C32.1 38.51,5.82 | 36.58,6.35 IC7.EP
  Top 0.203: R17.2 34.16,3.56 34.16,6.48 34.54,6.48 v34.54,6.73
  Top 0.254: 38.51,5.82 37.97,6.35 36.58,6.35 | R17.2 34.77,2.85 R16.2 | U4.A 34.16,7.49
  Top 0.406: C25.1 43.69,12.45 | C31.1 41.4,12.45
  Top 0.635: IC7.4 33.53,9.4 34.54,8.38 v34.54,8.26 | IC7.EP 35.18,7.49 | v42.16,13.34 C30.1 C26.1 v43.69,13.34 | C31.1 v42.16,13.34 | v43.69,13.34 43.69,12.45 41.4,12.45 | v41.4,13.34 v42.16,13.34 | v43.69,13.34 v44.45,13.34
  other vias: 35.43,7.49 36.32,8.26 36.32,6.73
  pour Bottom (rank 2): 32.13,1.27 38.99,1.27 38.99,8.76 45.72,8.76 45.72,19.05 39.12,19.05 39.12,11.3 35.69,11.3 35.69,8.89 33.91,8.89 33.91,11.3 32.13,11.3
RIGHT
  Top 0.254: C18.2 20.68,21.72 C14.1 20.6,21.54 R3.2
RS485D+  (via drill 0.38)
  Top 0.254: 3.56,1.14 K11.P$1
  Top 0.762: R13.1 v5.46,1.14 3.56,1.14
  Bottom 0.762: R10.1 v5.46,1.14
RS485D-  (via drill 0.38)
  Top 0.254: 16.26,1.14 K10.P$1
  Top 0.762: R12.1 v14.35,1.14 16.26,1.14
  Bottom 0.762: R10.2 v14.35,1.14
RXD  (via drill 0.38)
  Top 0.203: R14.2 R15.1 8.53,6.71 8.26,6.99 8.26,9.78 8.89,10.41 8.89,18.16 v9.14,18.41 | IC4.31 16.16,18.52 14.99,19.68 8.13,19.68 v7.87,19.43
  Bottom 0.203: v7.87,19.43 8.13,19.43 v9.14,18.41
TXD
  Top 0.203: IC3.4 7.62,9.91 8.38,10.67 8.38,18.8 8.76,19.18 14.73,19.18 15.51,18.4 IC4.32
TXEN/!RXEN  (via drill 0.38)
  Top 0.203: IC3.2 IC3.3 9.02,9.53 9.4,9.91 9.4,17.53 10.54,18.67 14.22,18.67 v14.61,18.29 | IC4.30 16.8,19.01 v16.51,19.3
  Bottom 0.203: v14.61,18.29 15.49,18.29 v16.51,19.3
USB-D+
  Top 0.203: K8.3 5.33,12.95 6.25,12.04 | 6.25,12.04 R21.2 | R11.2 6.25,12.04
USB-D-
  Top 0.203: K8.2 5.12,13.6 R20.2
VIN
  Top 0.254: R23.1 40.03,1.8 40.13,1.91 40.13,3.17 K3.P$1
  Top 0.635: IC7.2 36.07,10.92 36.5,11.35 40.26,11.35 41.53,10.08 41.53,9.45 | 41.53,9.45 C31.2 C25.2 44.07,5.97 K3.P$1 | 41.53,9.45 41.53,4.57
VREF
  Top 0.254: C6.2 29.23,16.18 C5.2 29.23,17.88 28.7,18.54 26.92,18.54 26.36,17.98 IC6.12
WCLK  (via drill 0.38)
  Top 0.203: IC6.2 24.41,10.69 23.62,9.91 19.68,9.91 v19.43,9.65 | IC4.12 17.45,10.47 v17.4,10.41
  Bottom 0.203: v17.4,10.41 18.67,10.41 v19.43,9.65

### Text on the board
tPlace: + | CAP | - | + | CAP | -
bPlace: - | + | - | + | TWEETER | WOOFER | Boot: / 1=normal / 0=update | .6 | 6 | PlayaBeats | D+ | D- | GND | +12V | DANGER / HI POWER
tDocu: LOOKING AT BOTTOM OF PCB
tBuild: PlayaBeats6 | (C) Kuy Mainwaring 2015 | 4x 1uF CAP 0603 | 4x 150kΩ RES 0603 | 2x 6.8nF CAP 0603 | 100Ω, 220kΩ, 100Ω, 220kΩ RES, 100nF CAP 0603 | 10Ω RES 0603 | 3x 22uF CAP 1206 | 1uF CAP 0603 | 2x FERRITE 0603 | 2x FERRITE 0603 | 100nF CAP 0603 | 100nF CAP 0603 | 22uF CAP 1206 | 2x 12pF CAP 0603 | 12MHz CRYSTAL | 1N4148 DIODE SOD323 | 2x 49.9Ω RES 0603 | 2x 22uF CAP 1206 | 1.5kΩ RES 0603 | 2x 10uF CAP 1206 | 6.8nF CAP 0603 | 5x 100nF CAP 0603 | 100kΩ RES 0603 | 2x 33Ω RES 0805 | 22kΩ RES 0603 | 6.8nF CAP 0603 | 100n CAP 0603 | 100kΩ RES 0603 | 6.8kΩ RES 0603 | 2x 1.5k RES 0603 | 2x 1uF CAP 0603 | HW MOD: 10kΩ 0402 to GND / - !SHUTDOWN! pull-down / - TX/!RX! pull-down